# Altium schematic sheet altium_chicker.SchDoc
size A4
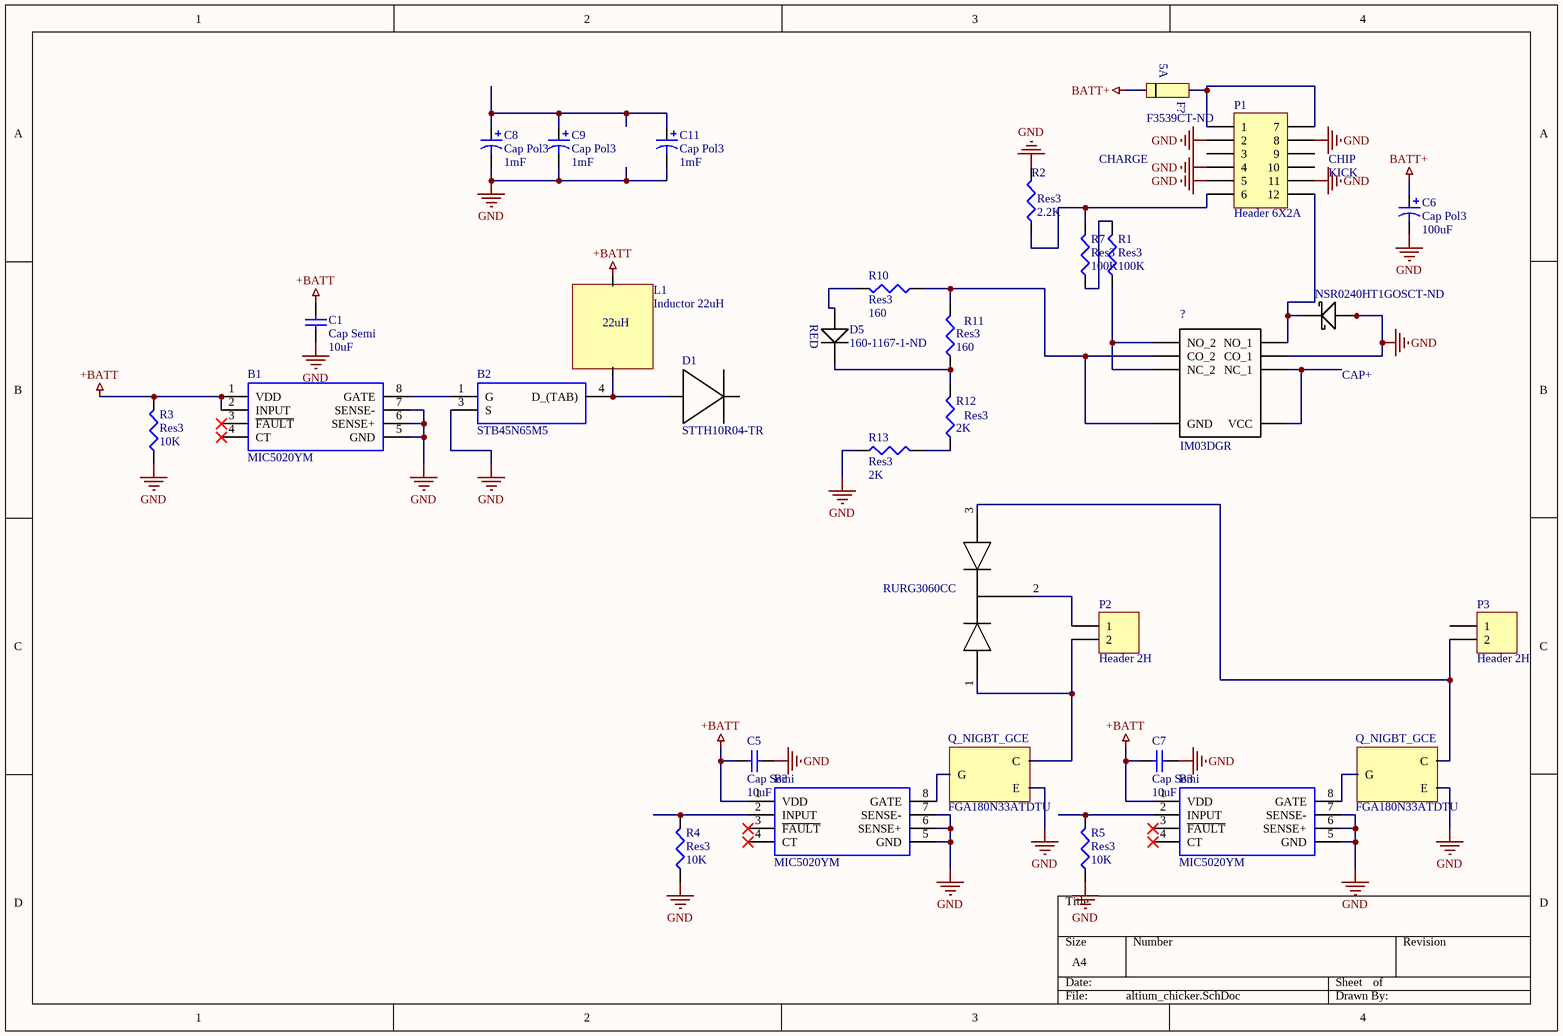
[diagram p0: altium_chicker.SchDoc]

## Parts
1  NSR0240HT1GOSCT-ND  [SOD2512X110N]
?  IM03DGR  [GULLWINGS]
B1  MIC5020YM  [SOIC127P600X188-8N]
B2  STB45N65M5  [TO254P1542X460-3N]
B3  MIC5020YM  [SOIC127P600X188-8N]
B?  MIC5020YM  [SOIC127P600X188-8N]
C1  Cap Semi  value 10uF  [C1206]
C5  Cap Semi  value 10uF  [C1206]
C6  Cap Pol3  value 100uF  [C0805]
C7  Cap Semi  value 10uF  [C1206]
C8  Cap Pol3  value 1mF  [C0805]
C9  Cap Pol3  value 1mF  [C0805]
C11  Cap Pol3  value 1mF  [C0805]
D1  STTH10R04-TR  [STTH10R04G-TR]
D3  RURG3060CC  [TO-247]  (value not drawn)
D5  160-1167-1-ND  [1206-C]
F1  F3539CT-ND  [1206-C]
L1  Inductor 22uH  [PCBComponent_1]
P1  Header 6X2A  [HDR2X6_CEN]
P2  Header 2H  [HDR1X2H]
P3  Header 2H  [HDR1X2H]
Q1  FGA180N33ATDTU  [TO-247]
Q2  FGA180N33ATDTU  [TO-247]
R1  Res3  value 100K  [J1-0603]
R2  Res3  value 2.2K  [J1-0603]
R3  Res3  value 10K  [J1-0603]
R4  Res3  value 10K  [J1-0603]
R5  Res3  value 10K  [J1-0603]
R7  Res3  value 100K  [J1-0603]
R10  Res3  value 160  [J1-0603]
R11  Res3  value 160  [J1-0603]
R12  Res3  value 2K  [J1-0603]
R13  Res3  value 2K  [J1-0603]

## Nets
+BATT: B1.1(VDD) B1.2(INPUT) B3.1(VDD) B?.1(VDD) C1.2 C5.1 C7.1 L1.1 R3.2
BATT+: C6.1 F1.10
GND: 1.12 ?.3(CO_1) B1.5(GND) B1.6(SENSE+) B1.7(SENSE-) B2.3(S) B3.5(GND) B3.6(SENSE+) B3.7(SENSE-) B?.5(GND) B?.6(SENSE+) B?.7(SENSE-) C1.1 C5.2 C6.2 C7.2 C8.2 C9.2 C11.2 P1.2 P1.4 P1.5 P1.8 P1.11 Q1.3(E) Q2.3(E) R2.2 R3.1 R4.1 R5.1 R13.1
Net1_11: 1.11 ?.4(NO_1) P1.12
Net?_1: ?.1(VCC) ?.2(NC_1)
Net?_5: ?.5(NO_2) ?.7(NC_2) R1.1
Net?_6: ?.6(CO_2) ?.8(GND) R10.1 R11.2
NetB1_8: B1.8(GATE) B2.1(G)
NetB2_4: B2.4(D_(TAB)) D1.0 L1.0
NetB3_2: B3.2(INPUT) R5.2
NetB3_8: B3.8(GATE) Q2.G
NetB?_2: B?.2(INPUT) R4.2
NetB?_8: B?.8(GATE) Q1.G
NetC8_1: C8.1 C9.1 C11.1
NetD3_1: D3.1 P2.2 Q1.4(C)
NetD3_2: D3.2 P2.1
NetD3_3: D3.3 P3.2 Q2.4(C)
NetD5_13: D5.13 R10.2
NetD5_14: D5.14 R11.1 R12.2
NetF1_9: F1.9 P1.1 P1.7
NetP1_6: P1.6 R2.1 R7.2
NetR1_2: R1.2 R7.1
NetR12_1: R12.1 R13.2

Not connected (* = marked no-connect by the designer): B1 3(~{FAULT})* 4(CT)*; B3 3(~{FAULT})* 4(CT)*; B? 3(~{FAULT})* 4(CT)*; D1 1; P1 3 9 10; P3 1

## Notes on the sheet
- CHARGE
- (near P1) CHIP
- KICK
- CAP+
- (in symbol 160-1167-1-ND) RED
- (in symbol F3539CT-ND) 5A; F?
- (in symbol FGA180N33ATDTU) Q_NIGBT_GCE
- (in symbol Inductor 22uH) 22uH

## Library data of the parts
? = IM03DGR: Relay, Signal, Dpdt, 250vac, 220vdc, 5a; MF: TE Connectivity; Package: None; Price: 2.90 USD; Availability: Bad; MP: IM03DGR; Value: *
B1 B3 B? = MIC5020YM: MICROCHIP - MIC5020YM - IC, DRIVER, MOSFET, LOW SIDE; Geometry.Height: 1.879mm; Supplier_Name: RS; RS Part Number: 9101537; Manufacturer_Name: Microchip; Manufacturer_Part_Number: MIC5020YM; Allied_Number: *; Other Part Number: *; Datasheet Link: http://ww1.microchip.com/downloads/en/devicedoc/mic5020.pdf; 3D Package: *
B2 = STB45N65M5: Manufacturer_Name: STMicroelectronics; Allied_Number: 70390681; Geometry.Height: 4.6mm; Supplier_Name: RS; RS Part Number: 7832949; Manufacturer_Part_Number: STB45N65M5; Other Part Number: *; Datasheet Link: http://www.st.com/web/en/resource/technical/document/datasheet/DM00049184.pdf; 3D Package: *
C1 C5 C7 = Cap Semi: Capacitor (Semiconductor SIM Model); Published: 8-Jun-2000; LatestRevisionDate: 29-May-2009; LatestRevisionNote: IPC-7351 Footprint Added.; PackageReference: C1206; Publisher: Altium Limited; PackageDescription: Chip Capacitor
C6 C8 C9 C11 = Cap Pol3: Polarized Capacitor (Surface Mount); Published: 8-Jun-2000; LatestRevisionDate: 29-May-2009; LatestRevisionNote: IPC-7351 Footprint Added.; PackageReference: C0805; Publisher: Altium Limited; PackageDescription: Chip Capacitor
P1 = Header 6X2A: Header, 6-Pin, Dual row; LatestRevisionDate: 17-Jul-2002; LatestRevisionNote: Re-released for DXP Platform.; Publisher: Altium Limited
P2 P3 = Header 2H: Header, 2-Pin, Right Angle; LatestRevisionDate: 17-Jul-2002; LatestRevisionNote: Re-released for DXP Platform.; Publisher: Altium Limited
R1-R5 R7 R10-R13 = Res3: Resistor; Published: 8-Jun-2000; LatestRevisionDate: 29-May-2009; LatestRevisionNote: IPC-7351 Footprint Added.; PackageReference: J1-0603; Publisher: Altium Limited; PackageDescription: Chip Resistor